# EAGLE design Power_Volume_PCB (EAGLE 9.6.1)
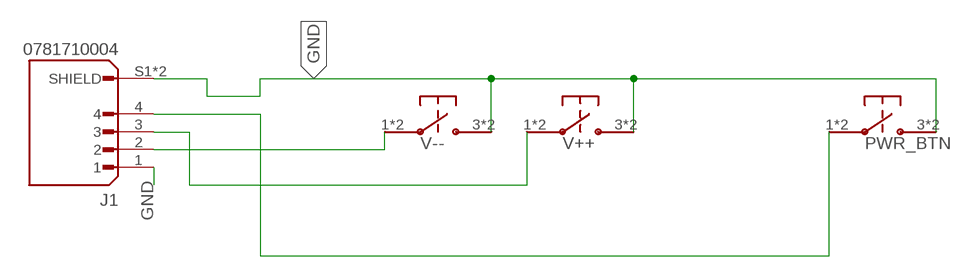
[diagram p0: schematic, sheet 1]

## Parts
J1  0781710004  [MOLEX_0781710004]
PWR_BTN  TL3315NF100Q  [TL3315NF100Q]
V++  TL3315NF100Q  [TL3315NF100Q]
V--  TL3315NF100Q  [TL3315NF100Q]

## Nets
GND: J1.1 J1.S1(SHIELD) J1.S2(SHIELD) PWR_BTN.3 PWR_BTN.4 V++.3 V++.4 V--.3 V--.4
N$1: J1.4 PWR_BTN.1 PWR_BTN.2
N$3: J1.3 V++.1 V++.2
N$5: J1.2 V--.1 V--.2

## Library data of the parts
J1 = 0781710004:0781710004: Connector Header Surface Mount 4 position 0.047in (1.20mm) Check availability <https://pricing.snapeda.com/parts/0781710004/Molex/view-part?ref=eda>; AVAILABILITY: In Stock; DESCRIPTION: Connector Header Surface Mount 4 position 0.047 (1.20mm); MF: Molex; MP: 0781710004; PACKAGE: None; PRICE: None; PURCHASE-URL: https://pricing.snapeda.com/search/part/0781710004/?ref=eda
PWR_BTN V++ V-- = TL3315NF100Q:TL3315NF100Q: SWITCH TACTILE SPST-NO 0.05A 15V; DESCRIPTION: Tactile Switch SPST-NO Top Actuated Surface Mount; DIGI-KEY_PART_NUMBER: EG4620CT-ND; MF: E-Switch; MP: TL3315NF100Q; PACKAGE: None; PURCHASE-URL: https://pricing.snapeda.com/search/part/TL3315NF100Q/?ref=eda

## Board
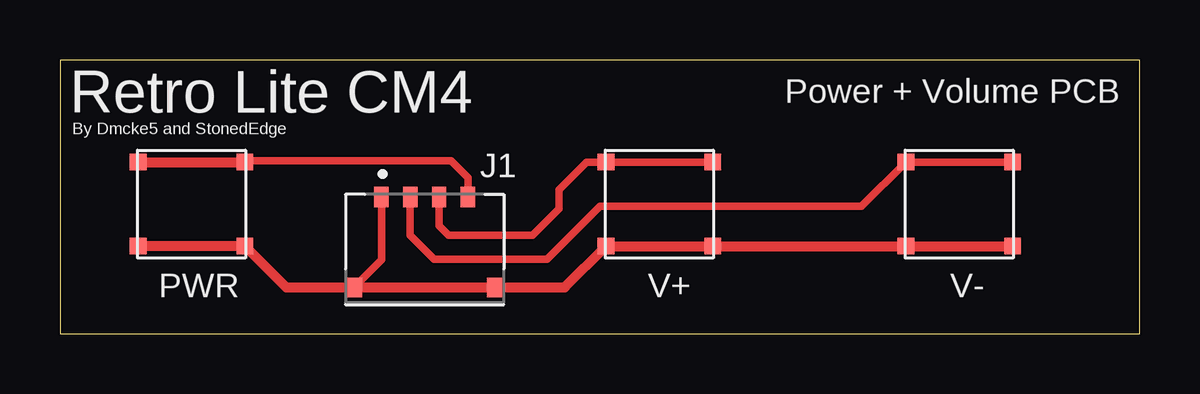
[diagram p1: board, top side]

Size 45 x 11.4 mm. Coordinates in mm from the lower left corner, seen from the top.
Outline: 45,11.4 0,11.4 0,0 45,0 45,11.4
Copper layers (1*16): Top 0.035mm / dielectric 1.6mm / Bottom 0.035mm
Design rules "jlcpcb-2layers": minimum track width 5mil, minimum drill 0.3mm, track to track 5mil, track to pad 5mil, pad to pad 5mil, via to via 5mil, smd to smd 5mil, copper to edge 0.2mm, drill to drill 6mil, minimum pad ring 10mil, minimum via ring 3mil, stop-mask expansion 4mil, vias tented up to drill 0mil, thermal gap 10mil

### Footprints (pad centres in the part's own frame; a part is rotated, then mirrored left to right if it is on the bottom)
MOLEX_0781710004 = smd 0.6 x 0.85: 1 -1.8,0; 2 -0.6,0; 3 0.6,0; 4 1.8,0 | smd 0.7 x 0.8: S1 2.95,-3.775; S2 -2.95,-3.775
TL3315NF100Q = smd 0.7 x 0.7: 1 -2.225,1.75; 2 2.225,1.75; 3 -2.225,-1.75; 4 2.225,-1.75

### Placement (x,y rotation side)
J1  15.2,5.7 0 top
PWR_BTN  5.49,5.4 0 top
V++  24.99,5.4 0 top
V--  37.48,5.4 0 top

### Tracks (layer width: path | path; a pad name or v marks a point on that pad's centre or on a via)
GND
  Top 0.305: J1.1 13.4,3.08 J1.S2
  Top 0.406: PWR_BTN.3 PWR_BTN.4 9.44,1.93 J1.S2 J1.S1 21.04,1.93 V++.3 V++.4 V--.3 V--.4
N$1
  Top 0.305: PWR_BTN.2 7.76,7.2 16.3,7.2 17,6.5 J1.4
  Top 0.406: PWR_BTN.1 PWR_BTN.2
N$3
  Top 0.305: V++.2 V++.1 21.95,7.15 20.8,6 20.8,5.2 19.7,4.1 16.2,4.1 15.8,4.5 J1.3
N$5
  Top 0.305: J1.2 14.6,4.1 15.6,3.1 20.3,3.1 22.5,5.3 33.41,5.3 V--.1 V--.2

### Text on the board
tNames: Power + Volume PCB | Retro Lite CM4 | By Dmcke5 and StonedEdge | PWR | V+ | V-